# EAGLE design Fan_Control_Test (EAGLE 9.6.2)
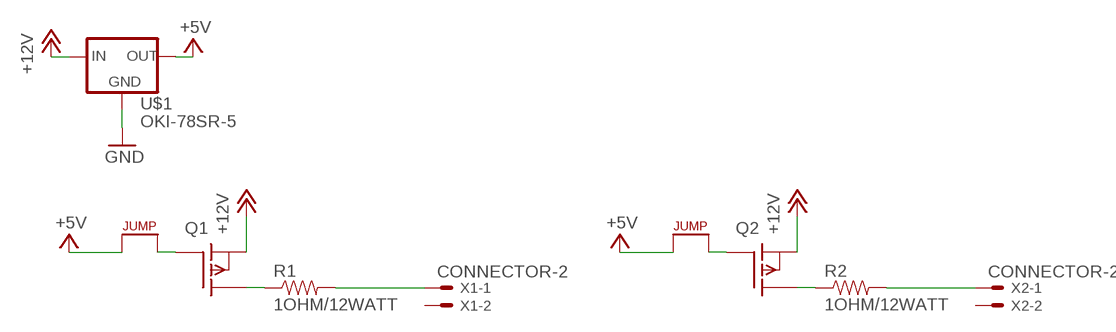
[diagram p0: schematic, sheet 1]

## Parts
J1  JUMPER.1  [1X02]
J3  JUMPER.1  [1X02]
Q1  P-CHANNEL_MOSFET_DMP3099L-7  [SOT23]
Q2  P-CHANNEL_MOSFET_DMP3099L-7  [SOT23]
R1  1OHM/12WATT  RESISTOR10W  [10W_RESISTOR_VISHAY]
R2  1OHM/12WATT  RESISTOR10W  [10W_RESISTOR_VISHAY]
U$1  OKI-78SR-5  [OKI-78SR]
X1  CONNECTOR-2  [MINIFIT_5566-2]
X2  CONNECTOR-2  [MINIFIT_5566-2]

## Nets
+5V: J1.1 J3.1 U$1.3(OUT)
+12V: Q1.2(S) Q2.2(S) U$1.1(IN)
GND: U$1.2(GND)
N$1: Q1.3(D) R1.1
N$2: J1.2 Q1.1(G)
N$3: R1.2 X1.1
N$4: Q2.3(D) R2.1
N$5: J3.2 Q2.1(G)
N$6: R2.2 X2.1
Unconnected: X1.2 X2.2

## Library data of the parts
J1 J3 = HyTechDevices:JUMPER: Jumper for changing operation of a device
Q1 Q2 = HyTechDevices:P-CHANNEL_MOSFET_DMP3099L-7: Diodes Incorporated P-Channel Enhancement Mode MOSFET Datasheet <http://www.mouser.com/ds/2/115/DMP3099L-266220.pdf>
R1 R2 = HyTechDevices:RESISTOR: Resistor Basic schematic elements and footprints for 0603, 1206, and PTH resistors.
U$1 = HyTechDevices:OKI-78SR-5: Murata OKI-78SR 5V 1.5A Non-Isolated Switching Regulator DC/DC - Datasheet <https://power.murata.com/data/power/oki-78sr.pdf>
X1 X2 = HyTechDevices:CONNECTOR-2: Mini-Fit Junior connector 2 pole Source: http://www.molex.com; OC_FARNELL: 1822072; OC_NEWARK: unknown

## Board
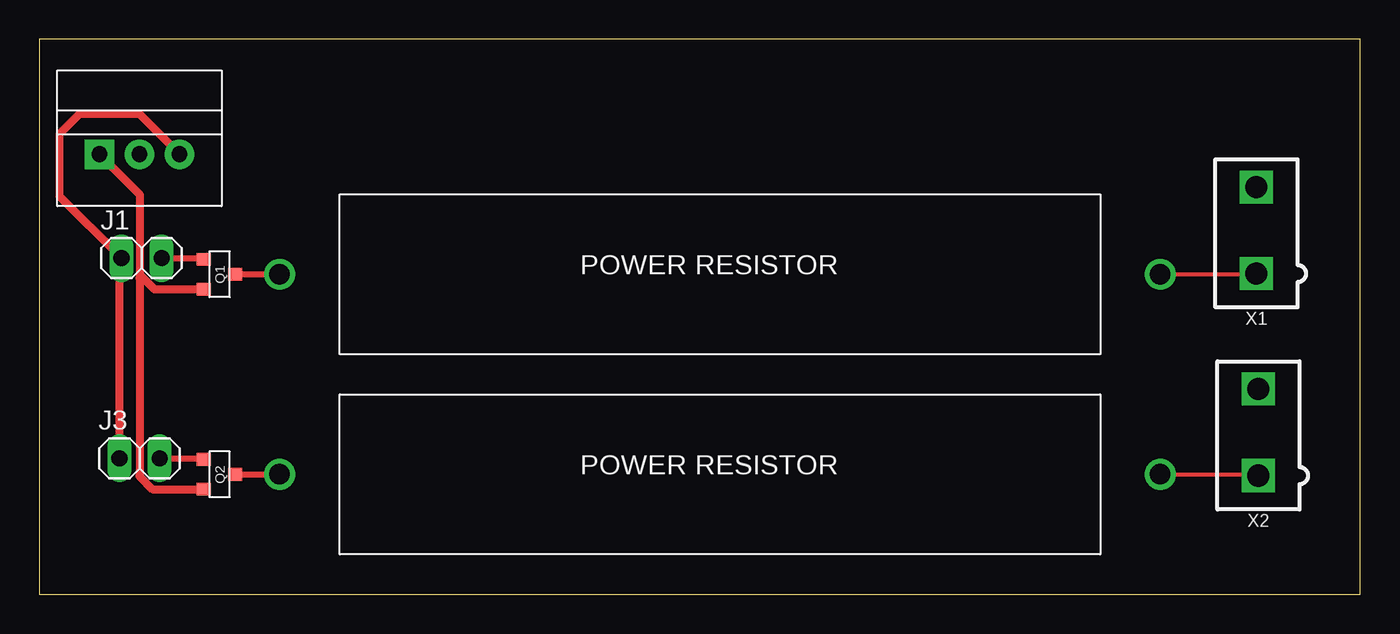
[diagram p1: board, top side]

Size 83.8 x 35.23 mm. Coordinates in mm from the lower left corner, seen from the top.
Outline: 0,0 83.8,0 83.8,35.23 0,35.23 0,0
Copper layers (1*16): Top 0.035mm / dielectric 1.5mm / Bottom 0.035mm
Design rules "default": minimum track width 6mil, minimum drill 0.35mm, track to track 6mil, track to pad 6mil, pad to pad 6mil, via to via 6mil, smd to smd 6mil, copper to edge 40mil, drill to drill 6mil, minimum pad ring 10mil, minimum via ring 8mil, stop-mask expansion 4mil, vias tented up to drill 0mil, thermal gap 10mil

### Footprints (pad centres in the part's own frame; a part is rotated, then mirrored left to right if it is on the bottom)
1X02 = drill 1.016 long: 1 -1.27,0; 2 1.27,0
SOT23 = smd 0.8 x 0.9: 1 -0.95,-1; 2 0.95,-1; 3 0,1
10W_RESISTOR_VISHAY = drill 1.3: 1 -3.81,0; 2 52.07,0
OKI-78SR = drill 1 pad 1.88 square: 1 -2.54,0 | drill 1 pad 1.88: 2 0,0; 3 2.54,0
MINIFIT_5566-2 = drill 1.4 square: 1 0,-2.75; 2 0,2.75

### Placement (x,y rotation side)
J1  6.48,21.34 0 top
J3  6.35,8.64 0 top
Q1  11.43,20.32 270 top
Q2  11.43,7.62 270 top
R1  19.05,20.32 0 top
R2  19.05,7.62 0 top
U$1  6.35,27.94 0 top
X1  77.22,23.11 0 top
X2  77.34,10.29 0 top

### Tracks (layer width: path | path; a pad name or v marks a point on that pad's centre or on a via)
+5V
  Top 0.508: U$1.3 6.35,30.48 2.54,30.48 1.27,29.21 1.27,25.27 5.08,21.46 | 5.08,21.46 J1.1 | J3.1 5.08,21.46
+12V
  Top 0.508: U$1.1 6.38,25.38 6.38,20.29 | 6.38,20.29 7.3,19.37 Q1.2 | 6.38,20.29 6.38,20.09 6.35,20.06 6.35,7.49 7.17,6.67 Q2.2
N$1
  Top 0.381: Q1.3 R1.1
N$2
  Top 0.254: 10.36,21.34 Q1.1
  Top 0.381: J1.2 10.36,21.34
N$3
  Top 0.254: R1.2 77.17,20.32 X1.1
N$4
  Top 0.381: Q2.3 R2.1
N$5
  Top 0.254: 10.36,8.64 Q2.1
  Top 0.381: J3.2 10.36,8.64
N$6
  Top 0.254: R2.2 77.26,7.62 X2.1